# EAGLE design solenoid_valve_slave_circuit (EAGLE 6.4)
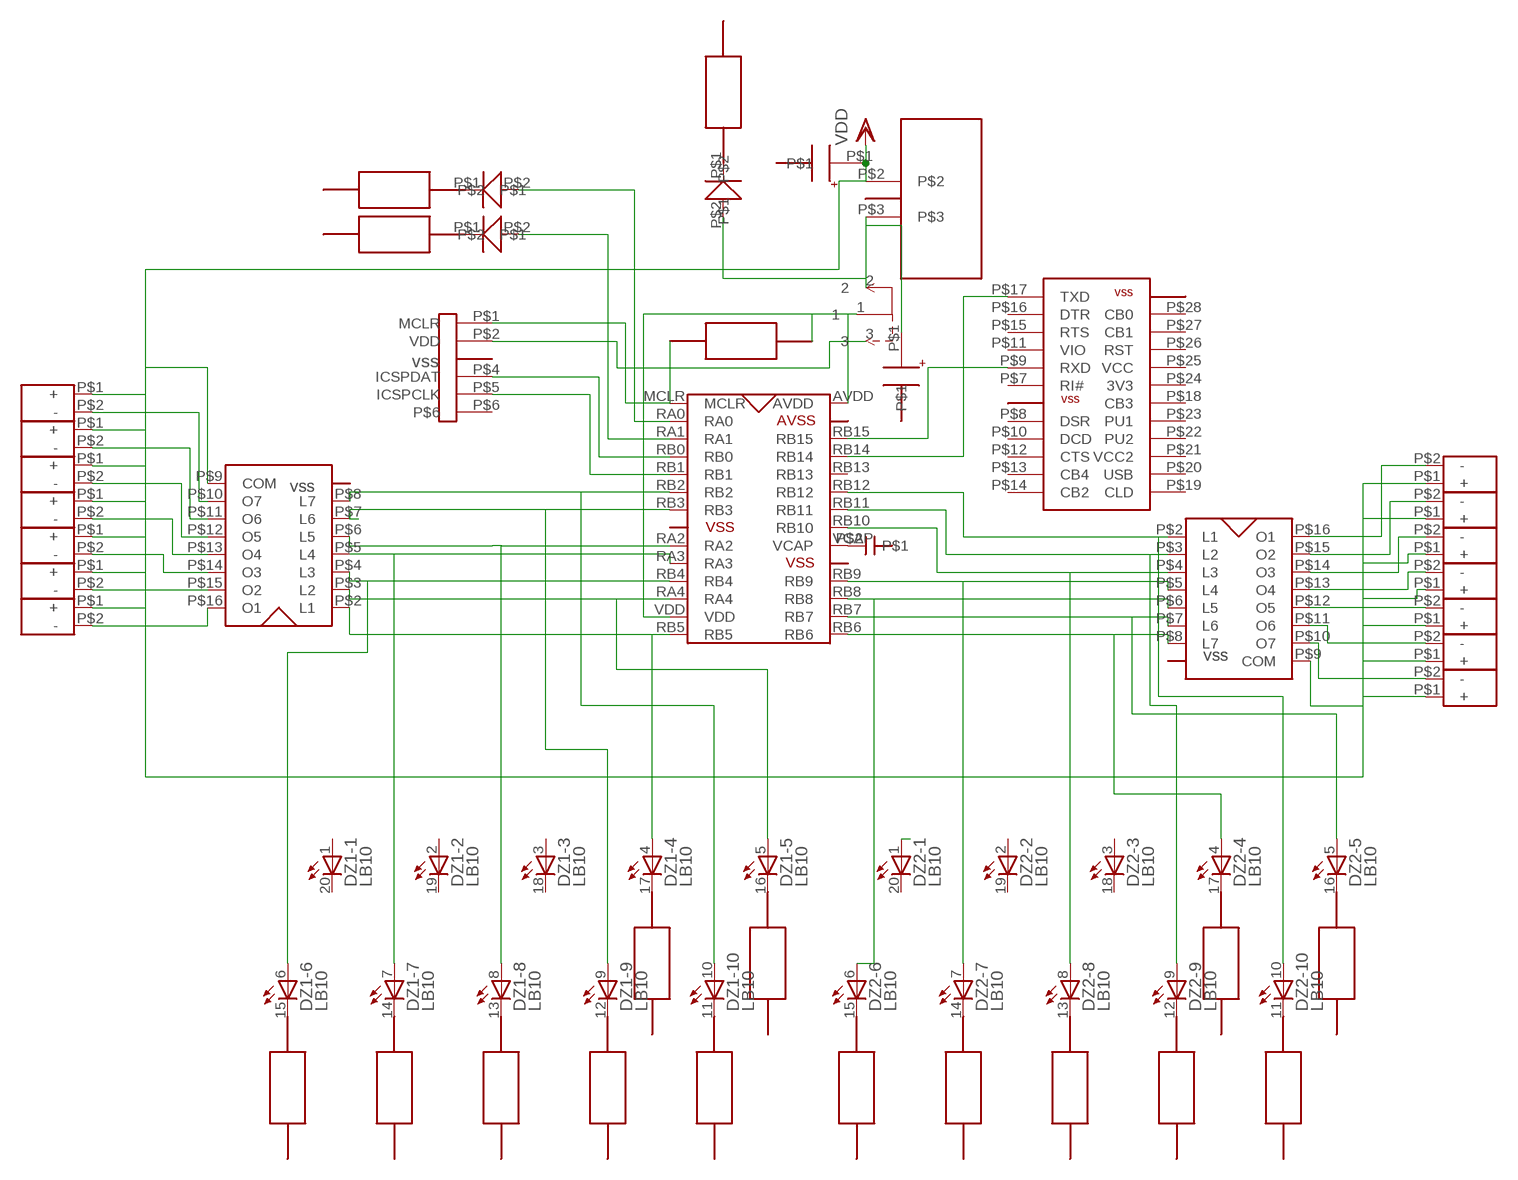
[diagram p0: schematic, sheet 1]

## Parts
DSPIC33FJ128MC1  DSPIC33FJ128MC  [PIC_28P_2]
DZ1  LB10  [LB10]
DZ2  LB10  [LB10]
SLIDE_SWITCH1  SLIDE_SWITCH_3  [SLIDE_SWITCH_3]
U$1  CAPACITOR_33  [CAPACITOR_33]
U$2  CHIP_RESISTOR  [CHIP_RESISTOR]
U$3  WRITER  [WRITER]
U$4  LED  [LED]
U$5  LED  [LED]
U$6  CHIP_RESISTOR  [CHIP_RESISTOR]
U$7  CHIP_RESISTOR  [CHIP_RESISTOR]
U$8  TRANSISTOR_TBD62003APG  [TRANSISTOR_TBD62003APG]
U$9  REGULATOR  [REGULATOR]
U$10  TRANSISTOR_TBD62003APG  [TRANSISTOR_TBD62003APG]
U$11  CAPACITORS_106  [CAPACITORS_106]
U$12  SERIALCOM  [SERIALCOM]
U$13  CHIP_RESISTOR  [CHIP_RESISTOR]
U$14  CHIP_RESISTOR  [CHIP_RESISTOR]
U$15  CHIP_RESISTOR  [CHIP_RESISTOR]
U$16  CHIP_RESISTOR  [CHIP_RESISTOR]
U$17  CHIP_RESISTOR  [CHIP_RESISTOR]
U$18  CHIP_RESISTOR  [CHIP_RESISTOR]
U$19  CHIP_RESISTOR  [CHIP_RESISTOR]
U$20  CHIP_RESISTOR  [CHIP_RESISTOR]
U$21  CHIP_RESISTOR  [CHIP_RESISTOR]
U$22  CHIP_RESISTOR  [CHIP_RESISTOR]
U$23  CHIP_RESISTOR  [CHIP_RESISTOR]
U$24  CHIP_RESISTOR  [CHIP_RESISTOR]
U$25  CHIP_RESISTOR  [CHIP_RESISTOR]
U$26  CHIP_RESISTOR  [CHIP_RESISTOR]
U$27  XHCONNECTOR_2PIN  [XHCONNECTOR_2PIN]
U$28  XHCONNECTOR_2PIN  [XHCONNECTOR_2PIN]
U$29  XHCONNECTOR_2PIN  [XHCONNECTOR_2PIN]
U$30  XHCONNECTOR_2PIN  [XHCONNECTOR_2PIN]
U$31  XHCONNECTOR_2PIN  [XHCONNECTOR_2PIN]
U$32  XHCONNECTOR_2PIN  [XHCONNECTOR_2PIN]
U$33  XHCONNECTOR_2PIN  [XHCONNECTOR_2PIN]
U$34  XHCONNECTOR_2PIN  [XHCONNECTOR_2PIN]
U$35  XHCONNECTOR_2PIN  [XHCONNECTOR_2PIN]
U$36  XHCONNECTOR_2PIN  [XHCONNECTOR_2PIN]
U$37  XHCONNECTOR_2PIN  [XHCONNECTOR_2PIN]
U$38  XHCONNECTOR_2PIN  [XHCONNECTOR_2PIN]
U$39  XHCONNECTOR_2PIN  [XHCONNECTOR_2PIN]
U$40  XHCONNECTOR_2PIN  [XHCONNECTOR_2PIN]
U$41  CAPACITOR_33  [CAPACITOR_33]
U$42  LED  [LED]
U$43  CHIP_RESISTOR  [CHIP_RESISTOR]

## Nets
N$1: SLIDE_SWITCH1.2 U$9.P$3 U$41.P$1 U$42.P$2
N$2: DSPIC33FJ128MC1.AVDD DSPIC33FJ128MC1.VDD SLIDE_SWITCH1.1
N$3: SLIDE_SWITCH1.3 U$3.P$2(VDD)
N$4: DSPIC33FJ128MC1.MCLR U$3.P$1(MCLR)
N$5: DSPIC33FJ128MC1.RB0 U$3.P$4(ICSPDAT)
N$6: DSPIC33FJ128MC1.RB1 U$3.P$5(ICSPCLK)
N$7: DSPIC33FJ128MC1.RA0 U$4.P$2
N$8: DSPIC33FJ128MC1.RA1 U$5.P$2
N$9: DSPIC33FJ128MC1.RB2 DZ1.10(-10:A) U$8.P$8(L7)
N$10: DSPIC33FJ128MC1.RA3 DZ1.7(-7:A) U$8.P$5(L4)
N$11: DSPIC33FJ128MC1.RA2 DZ1.8(-8:A) U$8.P$6(L5)
N$12: DSPIC33FJ128MC1.RB3 DZ1.9(-9:A) U$8.P$7(L6)
N$14: DSPIC33FJ128MC1.RA4 DZ1.5(-5:A) U$8.P$3(L2)
N$15: DSPIC33FJ128MC1.RB5 DZ1.4(-4:A) U$8.P$2(L1)
N$16: DSPIC33FJ128MC1.RB6 DZ2.4(-4:A) U$10.P$8(L7)
N$17: DSPIC33FJ128MC1.RB7 DZ2.5(-5:A) U$10.P$7(L6)
N$19: DZ2.1(-1:A)
N$20: DSPIC33FJ128MC1.RB10 DZ2.8(-8:A) U$10.P$4(L3)
N$21: DSPIC33FJ128MC1.RB11 DZ2.9(-9:A) U$10.P$3(L2)
N$22: DSPIC33FJ128MC1.RB12 DZ2.10(-10:A) U$10.P$2(L1)
N$23: DSPIC33FJ128MC1.VCAP U$11.P$2
N$24: DSPIC33FJ128MC1.RB15 U$12.P$9(RXD)
N$25: DSPIC33FJ128MC1.RB14 U$12.P$17(TXD)
N$26: U$10.P$10(O7) U$38.P$2(-)
N$27: U$10.P$11(O6) U$37.P$2(-)
N$28: U$10.P$12(O5) U$36.P$2(-)
N$29: U$10.P$13(O4) U$35.P$2(-)
N$30: U$8.P$10(O7) U$33.P$2(-)
N$31: U$8.P$11(O6) U$32.P$2(-)
N$32: U$8.P$12(O5) U$31.P$2(-)
N$33: U$8.P$13(O4) U$30.P$2(-)
N$34: U$8.P$14(O3) U$29.P$2(-)
N$35: U$8.P$15(O2) U$28.P$2(-)
N$36: U$8.P$16(O1) U$27.P$2(-)
N$37: U$10.P$14(O3) U$34.P$2(-)
N$38: U$10.P$15(O2) U$39.P$2(-)
N$39: U$10.P$16(O1) U$40.P$2(-)
N$45: DSPIC33FJ128MC1.RB9 DZ2.7(-7:A) U$10.P$5(L4)
N$46: DSPIC33FJ128MC1.RB8 DZ2.6(-6:A) U$10.P$6(L5)
N$47: DSPIC33FJ128MC1.RB4 DZ1.6(-6:A) U$8.P$4(L3)
VDD: U$1.P$1 U$8.P$9(COM) U$9.P$2 U$10.P$9(COM) U$27.P$1(+) U$28.P$1(+) U$29.P$1(+) U$30.P$1(+) U$31.P$1(+) U$32.P$1(+) U$33.P$1(+) U$34.P$1(+) U$35.P$1(+) U$36.P$1(+) U$37.P$1(+) U$38.P$1(+) U$39.P$1(+) U$40.P$1(+)
Unconnected: DSPIC33FJ128MC1.RB13 DZ1.1(-1:A) DZ1.2(-2:A) DZ1.3(-3:A) DZ1.11(-10:C) DZ1.12(-9:C) DZ1.13(-8:C) DZ1.14(-7:C) DZ1.15(-6:C) DZ1.16(-5:C) DZ1.17(-4:C) DZ1.18(-3:C) DZ1.19(-2:C) DZ1.20(-1:C) DZ2.2(-2:A) DZ2.3(-3:A) DZ2.11(-10:C) DZ2.12(-9:C) DZ2.13(-8:C) DZ2.14(-7:C) DZ2.15(-6:C) DZ2.16(-5:C) DZ2.17(-4:C) DZ2.18(-3:C) DZ2.19(-2:C) DZ2.20(-1:C) U$3.P$6 U$4.P$1 U$5.P$1 U$12.P$7(RI#) U$12.P$8(DSR) U$12.P$10(DCD) U$12.P$11(VIO) U$12.P$12(CTS) U$12.P$13(CB4) U$12.P$14(CB2) U$12.P$15(RTS) U$12.P$16(DTR) U$12.P$18(CB3) U$12.P$19(CLD) U$12.P$20(USB) U$12.P$21(VCC2) U$12.P$22(PU2) U$12.P$23(PU1) U$12.P$24(3V3) U$12.P$25(VCC) U$12.P$26(RST) U$12.P$27(CB1) U$12.P$28(CB0) U$42.P$1

## Library data of the parts
DSPIC33FJ128MC1 = N_MicroComputer:DSPIC33FJ128MC
DZ1 DZ2 = led:LB10: LED BLOCK 10-LED bar graph, DIL, Siemens
SLIDE_SWITCH1 = N_Switch:SLIDE_SWITCH_3
U$1 U$41 = oohira:CAPACITOR_33
U$2 U$6 U$7 U$13-U$26 U$43 = oohira:CHIP_RESISTOR
U$3 = oohira:WRITER
U$4 U$5 U$42 = oohira:LED
U$8 U$10 = TRANSISTOR_TBD62003APG:TRANSISTOR_TBD62003APG
U$9 = oohira:REGULATOR
U$11 = oohira:CAPACITORS_106
U$12 = oohira:SERIALCOM
U$27-U$40 = oohira:XHCONNECTOR_2PIN

## Board
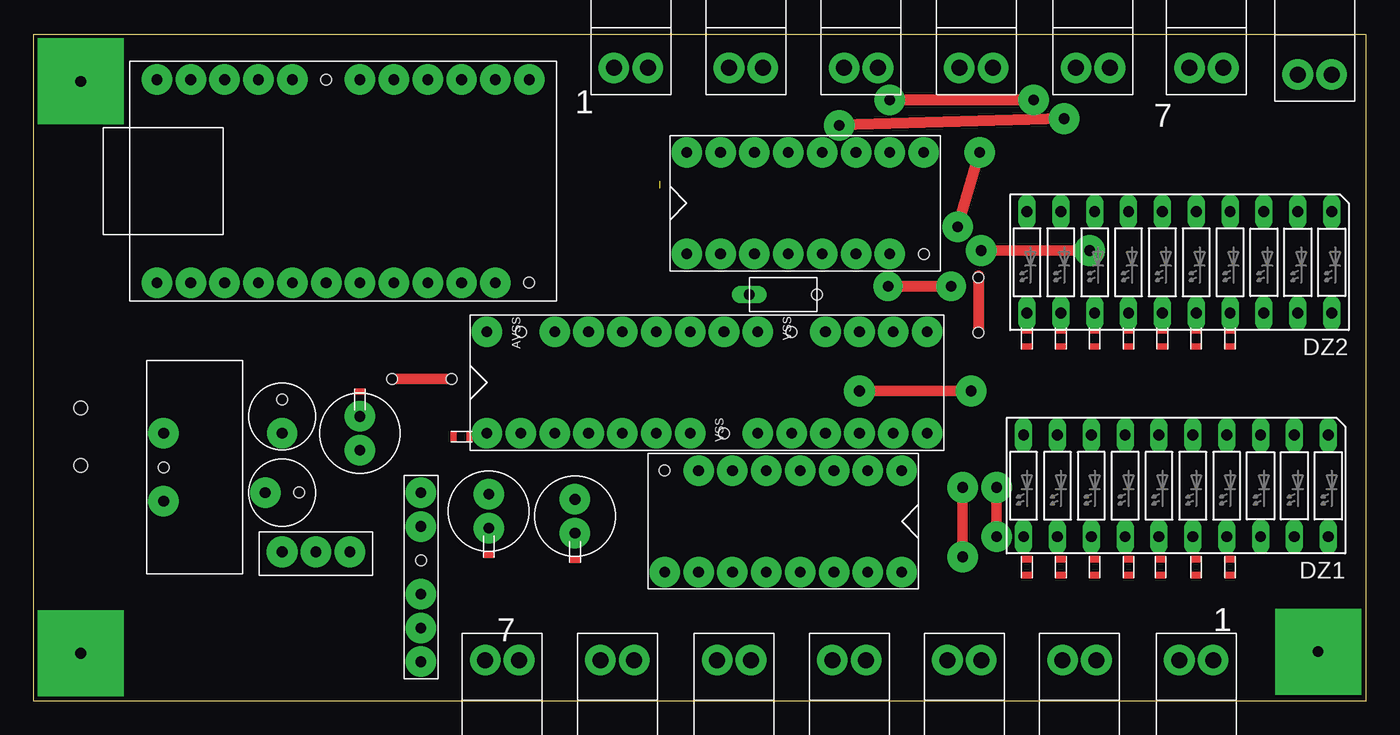
[diagram p1: board, top side]
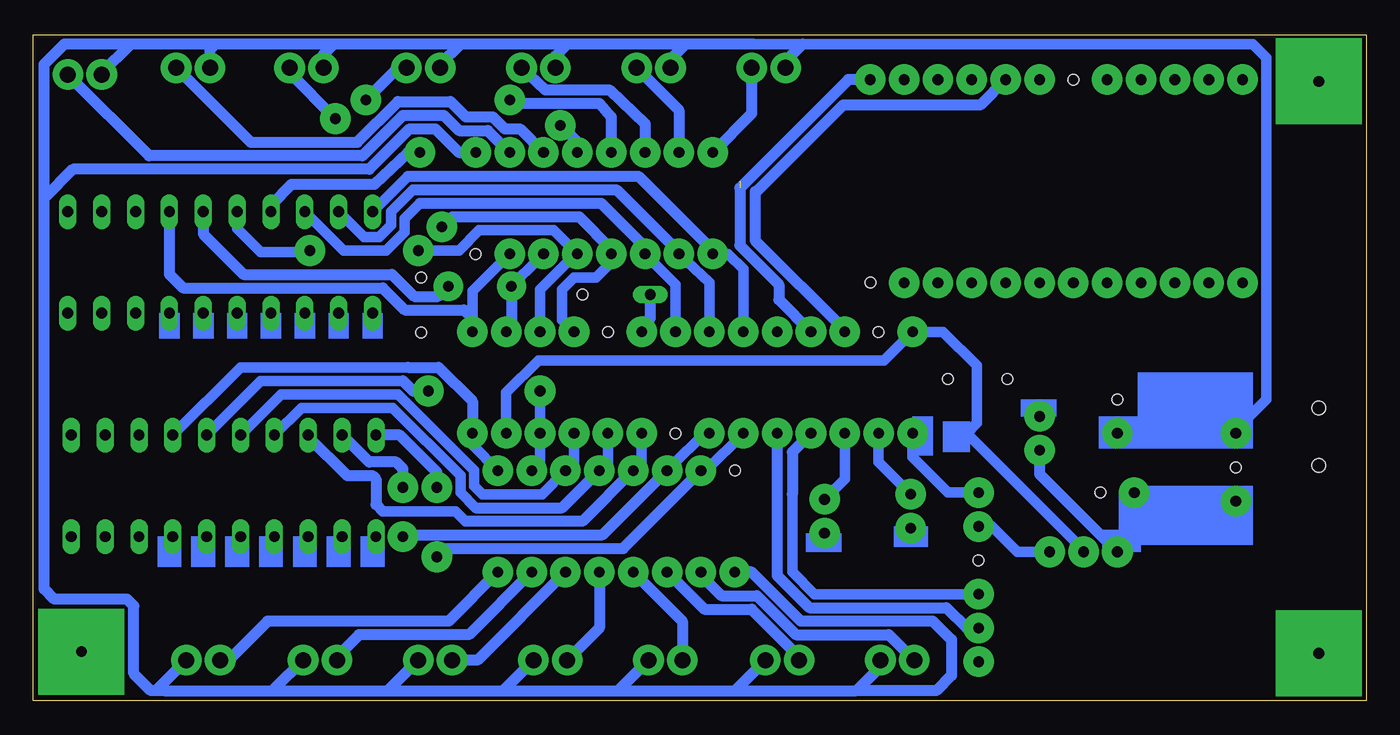
[diagram p2: board, bottom side, seen from below]

Size 100 x 50 mm. Coordinates in mm from the lower left corner, seen from the top.
Outline: 0,0 100,0 100,50 0,50 0,0
Copper layers (1*16): Top 0.035mm / dielectric 1.5mm / Bottom 0.035mm
Design rules "default": minimum track width 10mil, minimum drill 24mil, track to track 8mil, track to pad 8mil, pad to pad 8mil, via to via 8mil, smd to smd 8mil, copper to edge 40mil, drill to drill 8mil, minimum pad ring 10mil, minimum via ring 8mil, stop-mask expansion 4mil, vias tented up to drill 0mil, thermal gap 10mil
Holes 1 mm at 3.56,21.97 3.56,17.65
Holes 0.8 mm at 31.37,24.13 26.92,24.13 70.91,31.74 70.91,27.65

### Footprints (pad centres in the part's own frame; a part is rotated, then mirrored left to right if it is on the bottom)
PIC_28P_2 = drill 0.8 pad 2.3: AVDD 3.81,16.51; MCLR -3.81,16.51; RA0 -3.81,13.97; RA1 -3.81,11.43; RA2 -3.81,-3.81; RA3 -3.81,-6.35; RA4 -3.81,-11.43; RB0 -3.81,8.89; RB1 -3.81,6.35; RB2 -3.81,3.81; RB3 -3.81,1.27; RB4 -3.81,-8.89; RB5 -3.81,-16.51; RB6 3.81,-16.51; RB7 3.81,-13.97; RB8 3.81,-11.43; RB9 3.81,-8.89; RB10 3.81,-1.27; RB11 3.81,1.27; RB12 3.81,3.81; RB13 3.81,6.35; RB14 3.81,8.89; RB15 3.81,11.43; VCAP 3.81,-3.81; VDD -3.81,-13.97 | hole 0.8: -3.81,-1.27; 3.81,-6.35; 3.81,13.97
LB10 = drill 0.813 long: 1 -11.43,-3.81; 2 -8.89,-3.81; 3 -6.35,-3.81; 4 -3.81,-3.81; 5 -1.27,-3.81; 6 1.27,-3.81; 7 3.81,-3.81; 8 6.35,-3.81; 9 8.89,-3.81; 10 11.43,-3.81; 11 11.43,3.81; 12 8.89,3.81; 13 6.35,3.81; 14 3.81,3.81; 15 1.27,3.81; 16 -1.27,3.81; 17 -3.81,3.81; 18 -6.35,3.81; 19 -8.89,3.81; 20 -11.43,3.81
SLIDE_SWITCH_3 = drill 0.8 pad 2.3: 1 0,0; 2 -2.54,0; 3 2.54,0
CAPACITOR_33 = drill 0.8 pad 2.286: P$1 -1.27,0 | hole 0.8: 1.27,0
WRITER = drill 0.8 pad 2.286: P$1 -6.35,0; P$2 -3.81,0; P$4 1.27,0; P$5 3.81,0; P$6 6.35,0 | hole 0.8: -1.27,0
LED = drill 0.8 pad 2.286: P$1 -1.27,0; P$2 1.27,0
TRANSISTOR_TBD62003APG = drill 0.8 pad 2.286: P$2 -3.81,8.89; P$3 -3.81,6.35; P$4 -3.81,3.81; P$5 -3.81,1.27; P$6 -3.81,-1.27; P$7 -3.81,-3.81; P$8 -3.81,-6.35; P$9 3.81,-8.89; P$10 3.81,-6.35; P$11 3.81,-3.81; P$12 3.81,-1.27; P$13 3.81,1.27; P$14 3.81,3.81; P$15 3.81,6.35; P$16 3.81,8.89 | hole 0.8: -3.81,-8.89
REGULATOR = drill 0.8 pad 2.286: P$2 -2.54,1.27; P$3 2.54,1.27 | hole 0.8: 0,1.27
CAPACITORS_106 = drill 0.8 long: P$2 -2.54,0 | hole 0.8: 2.54,0
SERIALCOM = drill 0.8 pad 2.286: P$7 -7.62,1.27; P$8 -7.62,-3.81; P$9 -7.62,3.81; P$10 -7.62,-6.35; P$11 -7.62,6.35; P$12 -7.62,-8.89; P$13 -7.62,-11.43; P$14 -7.62,-13.97; P$15 -7.62,8.89; P$16 -7.62,11.43; P$17 -7.62,13.97; P$18 7.62,-1.27; P$19 7.62,-13.97; P$20 7.62,-11.43; P$21 7.62,-8.89; P$22 7.62,-6.35; P$23 7.62,-3.81; P$24 7.62,1.27; P$25 7.62,3.81; P$26 7.62,6.35; P$27 7.62,8.89; P$28 7.62,11.43 | hole 0.8: -7.62,-1.27; 7.62,13.97
XHCONNECTOR_2PIN = drill 1.2 pad 2.3: P$1 -1.27,0; P$2 1.27,0

### Placement (x,y rotation side)
DSPIC33FJ128MC1  50.55,23.88 90 top
DZ1  85.72,16.13 180 top
DZ2  85.98,32.89 180 top
SLIDE_SWITCH1  21.21,11.18 0 top
U$1  18.67,21.34 90 top
U$2  74.55,10.03 90 top
U$3  29.08,9.27 270 top
U$4  34.16,14.22 90 top
U$5  40.64,13.84 90 top
U$6  74.55,27.18 90 top
U$7  79.63,27.18 90 top
U$8  56.26,13.46 270 top
U$9  8.51,17.53 270 top
U$10  57.91,37.34 90 top
U$11  56.26,30.48 0 top
U$12  23.24,38.99 270 top
U$13  82.17,10.03 90 top
U$14  87.25,10.03 90 top
U$15  77.09,10.03 90 top
U$16  82.17,27.18 90 top
U$17  84.58,10.03 90 top
U$18  84.71,27.18 90 top
U$19  77.09,27.18 90 top
U$20  32.13,19.81 0 top
U$21  34.16,11.56 90 top
U$22  40.64,11.18 90 top
U$23  87.25,27.18 90 top
U$24  79.63,10.03 90 top
U$25  89.79,10.03 90 top
U$26  89.79,27.18 90 top
U$27  87.25,3.05 180 top
U$28  78.49,3.05 180 top
U$29  69.85,3.05 180 top
U$30  61.21,3.05 180 top
U$31  52.58,3.05 180 top
U$32  43.81,3.05 180 top
U$33  35.18,3.05 180 top
U$34  62.1,47.5 0 top
U$35  70.74,47.5 0 top
U$36  79.5,47.5 0 top
U$37  88.01,47.5 0 top
U$38  96.14,46.99 0 top
U$39  53.47,47.5 0 top
U$40  44.83,47.5 0 top
U$41  18.67,15.62 0 top
U$42  24.51,20.07 270 top
U$43  24.51,22.61 90 top

### Tracks (layer width: path | path; a pad name or v marks a point on that pad's centre or on a via)
N$1
  Bottom 0.8: U$9.P$3 10.41,15.62 U$41.P$1 17.4,12.45 SLIDE_SWITCH1.2
  Bottom 0.813: U$42.P$2 24.51,17.02 SLIDE_SWITCH1.2
N$2
  Bottom 0.8: DSPIC33FJ128MC1.VDD 64.52,23.11 62.1,25.53 36.2,25.53 DSPIC33FJ128MC1.AVDD 31.75,27.69 29.21,25.15 29.21,20.83 29.97,20.07 29.97,19.94 | SLIDE_SWITCH1.1 21.21,11.3 29.84,19.94 29.97,19.94 | 31.24,19.94 29.97,19.94
N$3
  Bottom 0.8: U$3.P$2 28.07,13.08 26.16,11.18 SLIDE_SWITCH1.3
N$4
  Bottom 0.8: 29.72,15.75 U$3.P$1 31.37,15.62 34.04,18.29 DSPIC33FJ128MC1.MCLR
N$5
  Bottom 0.8: 43.05,15.49 43.05,9.65 41.4,8 U$3.P$4
  Bottom 0.813: DSPIC33FJ128MC1.RB0 43.05,18.67 43.05,15.49
N$6
  Bottom 0.813: DSPIC33FJ128MC1.RB1 44.2,9.4 41.78,6.99 31.5,6.99 29.97,5.46 U$3.P$5
N$7
  Bottom 0.8: DSPIC33FJ128MC1.RA0 36.58,17.91 U$4.P$2
N$8
  Bottom 0.8: DSPIC33FJ128MC1.RA1 39.12,16.64 U$5.P$2
N$9  (via drill 0.8 pad 2.3)
  Top 0.8: v69.72,16 v69.72,10.79
  Bottom 0.8: DSPIC33FJ128MC1.RB2 49.53,17.27 U$8.P$8 | 69.09,11.43 v69.72,10.79
  Bottom 0.813: v69.72,16 69.72,17.14 72.52,19.94 DZ1.10 | 69.09,11.43 55.75,11.43 U$8.P$8
N$10
  Bottom 0.8: DSPIC33FJ128MC1.RA3 56.9,17.91 U$8.P$5 | 66.8,14.48 67.94,15.62 67.94,16.89 73.03,21.97 79.88,21.97 DZ1.7
  Bottom 0.813: 66.8,14.48 60.33,14.48 U$8.P$5
N$11
  Bottom 0.8: U$8.P$6 54.36,17.91 DSPIC33FJ128MC1.RA2 | 73.79,14.22 68.33,14.22 67.56,13.46
  Bottom 0.813: DZ1.8 79.38,19.81 76.45,16.89 74.55,16.89 74.3,16.64 74.3,14.73 73.79,14.22 | U$8.P$6 58.8,13.46 67.56,13.46
N$12  (via drill 0.8 pad 2.3)
  Top 0.8: v72.26,16 v72.26,12.32
  Bottom 0.8: DSPIC33FJ128MC1.RB3 49.66,20.07 52.07,17.65 U$8.P$7 | v72.26,12.32 72.01,12.45
  Bottom 0.813: v72.26,16 72.26,17.4 72.77,17.91 74.8,17.91 DZ1.9 | 72.01,12.45 57.28,12.45 52.07,17.65
N$13
  Top 0.8: 31.37,24.13 26.92,24.13
N$14  (via drill 0.8 pad 2.3)
  Top 0.8: v70.36,23.24 v61.98,23.24
  Bottom 0.8: U$8.P$3 61.98,17.91 DSPIC33FJ128MC1.RA4 v61.98,23.24 | 72.26,24 82.93,24 DZ1.5
  Bottom 0.813: v70.36,23.24 71.5,23.24 72.26,24
N$15
  Bottom 0.8: U$8.P$2 67.06,19.18 DSPIC33FJ128MC1.RB5 | 71.88,25.02 84.45,25.02 DZ1.4
  Bottom 0.813: 71.88,25.02 69.6,25.02 67.06,22.48 DSPIC33FJ128MC1.RB5
N$16
  Bottom 0.8: U$10.P$8 67.06,30.73 DSPIC33FJ128MC1.RB6
  Bottom 0.813: DZ2.4 89.79,32 88.77,30.99 73.79,30.99 72.14,29.34 67.69,29.34 67.06,28.7 DSPIC33FJ128MC1.RB6
N$17  (via drill 0.8 pad 2.18)
  Top 0.813: v64.13,31.1 v68.86,31.1
  Bottom 0.8: U$10.P$7 64.52,30.73 v64.13,31.1
  Bottom 0.813: DZ2.5 87.25,35.02 84.22,32 73.09,32 71.42,30.34 69.63,30.34 v68.86,31.1 | v64.13,31.1 64.13,28.07 DSPIC33FJ128MC1.RB7
N$20
  Bottom 0.8: U$10.P$4 51.82,31.24 DSPIC33FJ128MC1.RB10 | DZ2.8 76.71,33.78 73.53,33.78 72.14,35.18 72.14,36.2 70.99,37.34
  Bottom 0.813: 70.99,37.34 57.4,37.34 54.1,34.04 U$10.P$4
N$21
  Bottom 0.8: U$10.P$3 49.28,31.37 DSPIC33FJ128MC1.RB11 | 71.5,38.35 73.15,36.7 73.15,35.69 74.04,34.8 75.18,34.8 DZ2.9
  Bottom 0.813: 71.5,38.35 56.26,38.35 51.56,33.66 U$10.P$3
N$22
  Bottom 0.8: U$10.P$2 47.88,33.53 46.74,32.38 DSPIC33FJ128MC1.RB12 | 71.88,39.37 DZ2.10
  Bottom 0.813: 71.88,39.37 54.61,39.37 49.02,33.78 U$10.P$2
N$23
  Bottom 0.813: U$11.P$2 53.72,28.7 DSPIC33FJ128MC1.VCAP
N$24
  Bottom 0.813: 45.85,38.23 45.85,38.1 | 45.85,38.1 45.85,34.54 39.12,27.81 DSPIC33FJ128MC1.RB15 | U$12.P$9 28.96,44.7 39.24,44.7 45.85,38.1
N$25  (1 unrouted)
  Bottom 0.813: DSPIC33FJ128MC1.RB14 44.07,30.1 44.07,31.24 46.99,34.16 46.99,38.48 38.86,46.61 U$12.P$17
N$26
  Bottom 0.813: 64.39,41.15 U$10.P$10 65.91,42.8 68.07,42.8 69.22,43.94 72.26,43.94 75.31,40.89 91.31,40.89 U$38.P$2
N$27
  Bottom 0.813: U$10.P$11 63.5,42.93 64.64,42.93 65.53,43.81 67.56,43.81 68.71,44.96 72.64,44.96 75.69,41.91 83.69,41.91 U$37.P$2
N$28  (via drill 0.8 pad 2.3)
  Top 0.813: v77.34,43.69 v60.45,43.18
  Bottom 0.813: U$36.P$2 80.77,47.12 v77.34,43.69 | v60.45,43.18 59.18,41.91 U$10.P$12
N$29  (via drill 0.8 pad 2.3)
  Top 0.813: v75.06,45.09 v64.26,45.09
  Bottom 0.813: U$35.P$2 72.64,47.5 v75.06,45.09 | v64.26,45.09 64.14,44.96 63.63,44.83 57.53,44.83 56.64,43.81 U$10.P$13
N$30
  Bottom 0.813: U$33.P$2 35.81,4.95 42.8,4.95 45.72,7.87 48.39,7.87 49.91,9.4 U$8.P$10
N$31
  Bottom 0.813: U$8.P$11 49.66,6.86 46.1,6.86 42.55,3.3 U$32.P$2
N$32
  Bottom 0.813: U$8.P$12 51.31,5.97 U$31.P$2
N$33
  Bottom 0.813: U$8.P$13 57.53,5.46 U$30.P$2
N$34
  Bottom 0.813: U$8.P$14 66.67,3.05 U$29.P$2
N$35
  Bottom 0.813: U$8.P$15 67.31,4.95 75.56,4.95 77.22,3.3 U$28.P$2
N$36
  Bottom 0.813: U$8.P$16 68.83,5.97 82.42,5.97 85.34,3.05 U$27.P$2
N$37
  Bottom 0.813: U$34.P$2 61.59,45.85 56.77,45.85 54.1,43.31 U$10.P$14
N$38
  Bottom 0.813: U$39.P$2 51.56,44.32 U$10.P$15
N$39
  Bottom 0.813: U$40.P$2 46.1,44.07 U$10.P$16
N$40  (via drill 0.8 pad 6.45)
  other vias: 3.56,46.48
N$41  (via drill 0.8 pad 6.45)
  other vias: 3.56,3.56
N$42  (via drill 0.8 pad 6.45)
  other vias: 96.39,3.68
N$44
  Top 0.813: 70.91,31.87 70.91,27.65
N$45  (via drill 0.8 pad 2.3)
  Top 0.8: v70.99,41.15 v69.34,35.56
  Bottom 0.8: U$10.P$5 56.64,32.89 57.78,31.75 59.44,31.75 60.33,30.86 60.33,28.57 DSPIC33FJ128MC1.RB9
  Bottom 0.813: v69.34,35.56 68.58,36.32 59.05,36.32 56.64,33.91 U$10.P$5 | v70.99,41.15 71.88,41.15 74.42,38.73 80.64,38.73 82.17,37.21 DZ2.7
N$46  (via drill 0.8 pad 2.3)
  Top 0.8: v79.25,33.78 v71.12,33.78
  Bottom 0.8: DZ2.6 84.71,35.43 82.93,33.66 79.38,33.66 v79.25,33.78 | v71.12,33.78 68.07,33.78 66.55,35.31 60.96,35.31 U$10.P$6 59.31,33.53 61.98,30.86 DSPIC33FJ128MC1.RB8
N$47
  Bottom 0.8: DSPIC33FJ128MC1.RB4 59.44,17.91 U$8.P$4 61.85,15.49 66.29,15.49 66.93,16.13 66.93,17.27 72.64,22.99 81.41,22.99 DZ1.6
VDD
  Bottom 0.8: U$9.P$2 U$1.P$1 18.54,20.19 9.91,20.19 7.49,22.61 7.49,48.26 8.51,49.28 42.29,49.28 45.97,49.28 | 90.04,0.76 90.17,0.76
  Bottom 0.813: 81.92,0.76 90.17,0.76 90.81,0.76 | 81.92,0.76 73.41,0.76 | 73.41,0.76 64.77,0.76 | 64.77,0.76 56.13,0.76 | 56.13,0.76 47.37,0.76 | 47.37,0.76 38.23,0.76 | 99.19,37.72 99.19,8.38 98.42,7.62 92.96,7.62 92.46,7.11 92.46,2.03 91.19,0.76 90.81,0.76 | 99.19,37.72 99.19,47.75 97.66,49.28 92.71,49.28 | 45.97,49.28 51.05,49.28 | 51.05,49.28 59.94,49.28 | 59.94,49.28 67.94,49.28 | 67.94,49.28 77.47,49.28 | 77.47,49.28 86.36,49.28 | 86.36,49.28 92.71,49.28 | 66.8,41.27 U$10.P$9 68.07,41.15 69.85,42.93 71.75,42.93 74.8,39.88 97.03,39.88 99.19,37.72 | 38.23,0.76 36.45,2.54 U$33.P$1 | 38.23,0.76 32.26,0.76 31.11,1.91 31.11,4.57 32.51,5.97 42.42,5.97 46.1,9.65 U$8.P$9 | U$27.P$1 90.81,0.76 | U$28.P$1 81.92,0.89 81.92,0.76 | U$29.P$1 73.41,0.76 | U$30.P$1 64.77,0.76 | U$31.P$1 56.13,0.76 | U$32.P$1 47.37,0.76 | U$40.P$1 43.56,48.01 42.29,49.28 | U$39.P$1 52.2,48.13 51.05,49.28 | U$34.P$1 60.83,48.39 59.94,49.28 | U$35.P$1 69.47,47.75 67.94,49.28 | U$36.P$1 78.23,48.51 77.47,49.28 | U$37.P$1 86.74,48.9 86.36,49.28 | U$38.P$1 94.87,47.12 92.71,49.28
(copper drawn outside any net)
  shapes: Bottom area x27

### Text on the board
tPlace: 1 | 7 | 1 | 7